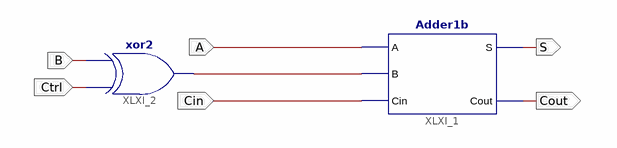
[diagram p0: schematic sheet 1]
// Xilinx ISE schematic AddSub1b.sch (kintex7) as structural Verilog: 2 symbols, 6 ports
module AddSub1b (
  input  A,
  input  B,
  input  Ctrl,
  input  Cin,
  output S,
  output Cout
);

  wire XLXN_2;

  Adder1b XLXI_1 (.A(A), .B(XLXN_2), .Cin(Cin), .S(S), .Cout(Cout));
  xor XLXI_2 (XLXN_2, Ctrl, B);
endmodule
